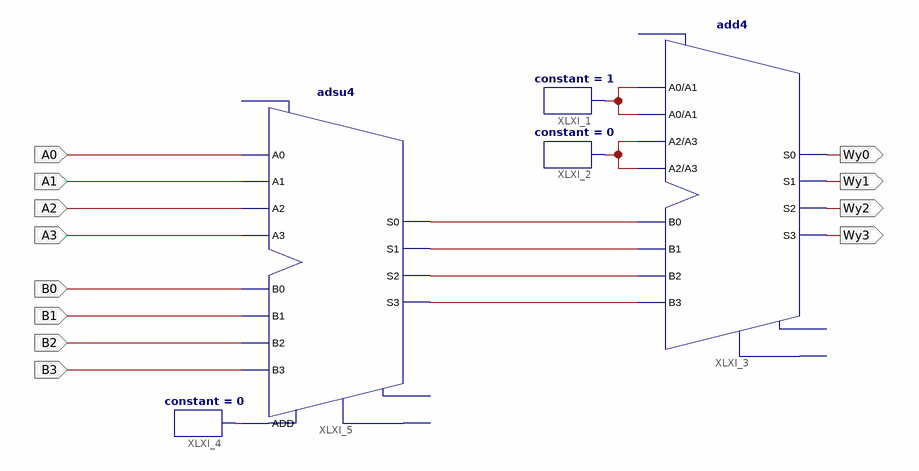
[diagram p0: schematic sheet 1]
// Xilinx ISE schematic zad2.sch (artix7) as structural Verilog: 5 symbols, 12 ports
module zad2 (
  input  A0,
  input  A1,
  input  A2,
  input  A3,
  input  B0,
  input  B1,
  input  B2,
  input  B3,
  output Wy0,
  output Wy1,
  output Wy2,
  output Wy3
);

  wire XLXN_9, XLXN_10, XLXN_11, XLXN_12, XLXN_13, XLXN_21, XLXN_23;

  constant #(.CValue("1")) XLXI_1 (.O(XLXN_13));
  constant #(.CValue("0")) XLXI_2 (.O(XLXN_21));
  add4 XLXI_3 (
    .A0(XLXN_13), .A1(XLXN_13), .A2(XLXN_21), .A3(XLXN_21), .B0(XLXN_12), .B1(XLXN_11), .B2(XLXN_10),
    .B3(XLXN_9), .S0(Wy0), .S1(Wy1), .S2(Wy2), .S3(Wy3));  // open: CI, CO, OFL
  constant #(.CValue("0")) XLXI_4 (.O(XLXN_23));
  adsu4 XLXI_5 (
    .A0(A0), .A1(A1), .A2(A2), .A3(A3), .ADD(XLXN_23), .B0(B0), .B1(B1), .B2(B2), .B3(B3), .S0(XLXN_12),
    .S1(XLXN_11), .S2(XLXN_10), .S3(XLXN_9));  // open: CI, CO, OFL
endmodule
